# EAGLE design DMXto16Ch (EAGLE 9.2.2)
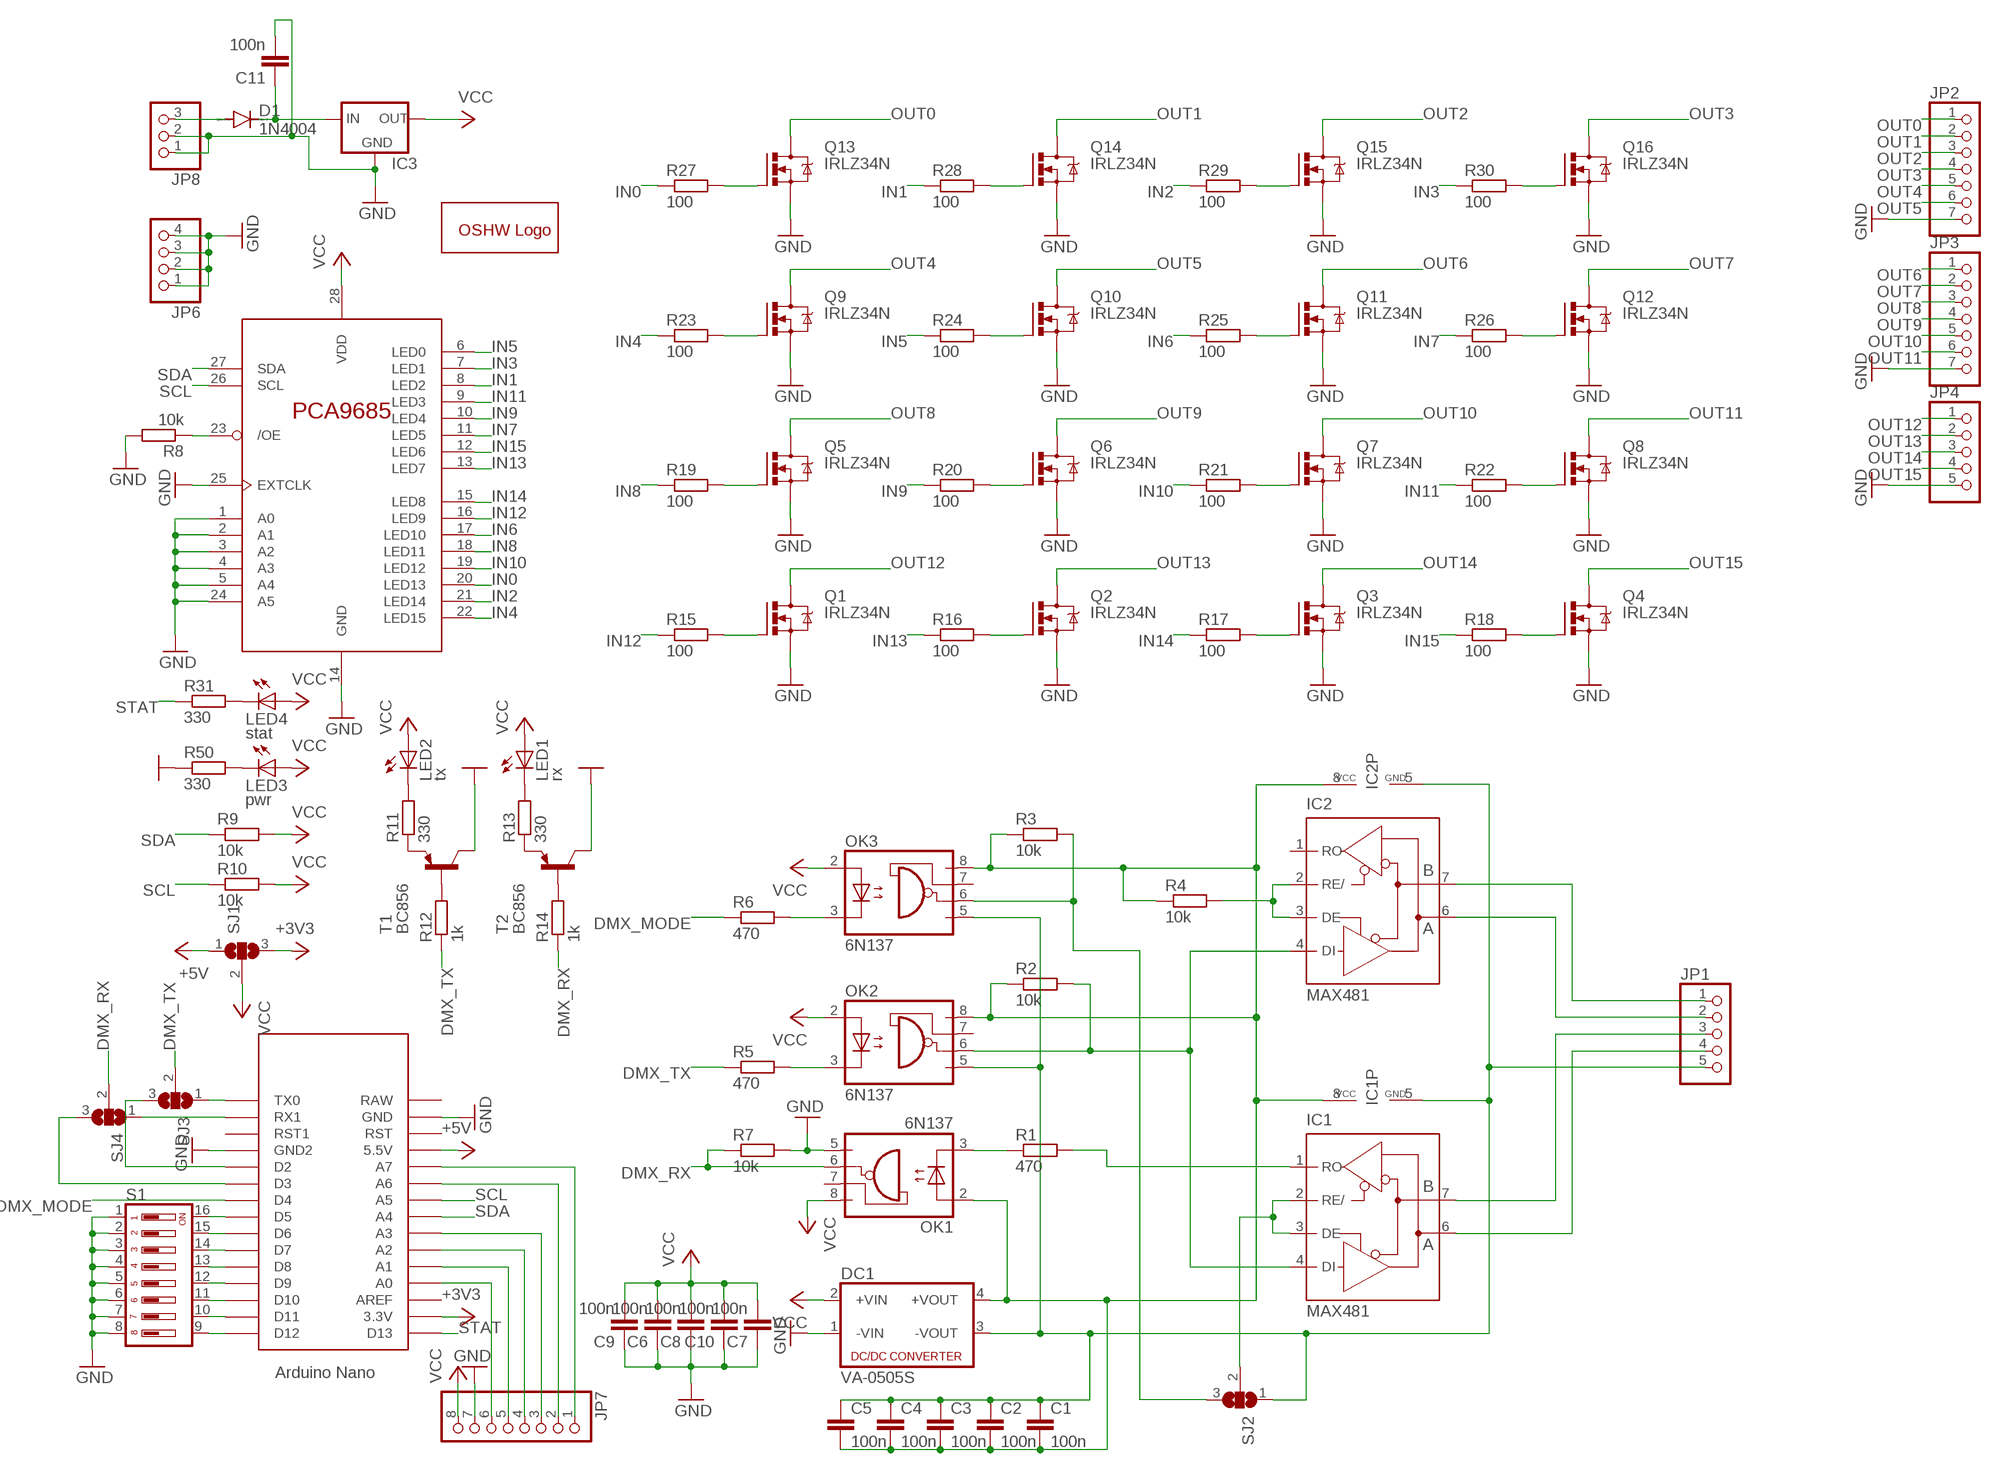
[diagram p0: schematic, sheet 1]

## Parts
C1  100n  C-EUC1206  [C1206]
C2  100n  C-EUC1206  [C1206]
C3  100n  C-EUC1206  [C1206]
C4  100n  C-EUC1206  [C1206]
C5  100n  C-EUC1206  [C1206]
C6  100n  C-EUC1206  [C1206]
C7  100n  C-EUC1206  [C1206]
C8  100n  C-EUC1206  [C1206]
C9  100n  C-EUC1206  [C1206]
C10  100n  C-EUC1206  [C1206]
C11  100n  C-EUC1206  [C1206]
D1  1N4004  [DO41-10]
DC1  VA-0505S  [4SIL]
GOLD_ORB_SM1  OSHWLOGOLOGO5MM  [OSHW_5MM]
IC1  MAX481  MAX481CPA  [DIL08]
IC2  MAX481  MAX481CPA  [DIL08]
IC3  78XXS  [78XXS]
JP1  PINHD-1X5  [1X05]
JP2  PINHD-1X7  [1X07]
JP3  PINHD-1X7  [1X07]
JP4  PINHD-1X5  [1X05]
JP6  PINHD-1X4  [1X04]
JP7  PINHD-1X8  [1X08]
JP8  PINHD-1X3  [1X03]
LED1  rx  LEDSMT1206  [1206]
LED2  tx  LEDSMT1206  [1206]
LED3  pwr  LEDSMT1206  [1206]
LED4  stat  LEDSMT1206  [1206]
OK1  6N137  [DIL08]
OK2  6N137  [DIL08]
OK3  6N137  [DIL08]
Q1  IRLZ34N  IRF520  [TO220BV]
Q2  IRLZ34N  IRF520  [TO220BV]
Q3  IRLZ34N  IRF520  [TO220BV]
Q4  IRLZ34N  IRF520  [TO220BV]
Q5  IRLZ34N  IRF520  [TO220BV]
Q6  IRLZ34N  IRF520  [TO220BV]
Q7  IRLZ34N  IRF520  [TO220BV]
Q8  IRLZ34N  IRF520  [TO220BV]
Q9  IRLZ34N  IRF520  [TO220BV]
Q10  IRLZ34N  IRF520  [TO220BV]
Q11  IRLZ34N  IRF520  [TO220BV]
Q12  IRLZ34N  IRF520  [TO220BV]
Q13  IRLZ34N  IRF520  [TO220BV]
Q14  IRLZ34N  IRF520  [TO220BV]
Q15  IRLZ34N  IRF520  [TO220BV]
Q16  IRLZ34N  IRF520  [TO220BV]
R1  470  R-EU_R1206  [R1206]
R2  10k  R-EU_R1206  [R1206]
R3  10k  R-EU_R1206  [R1206]
R4  10k  R-EU_R1206  [R1206]
R5  470  R-EU_R1206  [R1206]
R6  470  R-EU_R1206  [R1206]
R7  10k  R-EU_R1206  [R1206]
R8  10k  R-EU_R1206  [R1206]
R9  10k  R-EU_R1206  [R1206]
R10  10k  R-EU_R1206  [R1206]
R11  330  R-EU_R1206  [R1206]
R12  1k  R-EU_R1206  [R1206]
R13  330  R-EU_R1206  [R1206]
R14  1k  R-EU_R1206  [R1206]
R15  100  R-EU_R1206  [R1206]
R16  100  R-EU_R1206  [R1206]
R17  100  R-EU_R1206  [R1206]
R18  100  R-EU_R1206  [R1206]
R19  100  R-EU_R1206  [R1206]
R20  100  R-EU_R1206  [R1206]
R21  100  R-EU_R1206  [R1206]
R22  100  R-EU_R1206  [R1206]
R23  100  R-EU_R1206  [R1206]
R24  100  R-EU_R1206  [R1206]
R25  100  R-EU_R1206  [R1206]
R26  100  R-EU_R1206  [R1206]
R27  100  R-EU_R1206  [R1206]
R28  100  R-EU_R1206  [R1206]
R29  100  R-EU_R1206  [R1206]
R30  100  R-EU_R1206  [R1206]
R31  330  R-EU_R1206  [R1206]
R50  330  R-EU_R1206  [R1206]
S1  DIP08YL  [DIP08YL]
SJ1  SJ2W  [SJ_2]
SJ2  SJ2W  [SJ_2]
SJ3  SJ2W  [SJ_2]
SJ4  SJ2W  [SJ_2]
T1  BC856  -PNP-SOT23-BCE  [SOT23-BCE]
T2  BC856  -PNP-SOT23-BCE  [SOT23-BCE]
U$1  NANO  [NANO]
U$2  PCA9685PW  [TSSOP28]

## Nets
+3V3: SJ1.3 U$1.3.3V
+5V: SJ1.1 U$1.5V(5.5V)
DMX_MODE: R6.1 U$1.D4
DMX_RX: OK1.6(VO) R7.1 R14.1 SJ4.2
DMX_TX: R5.1 R12.1 SJ3.2
GND: C6.1 C7.1 C8.1 C9.1 C10.1 C11.2 DC1.1(-VIN) IC3.GND JP2.7 JP3.7 JP4.5 JP6.1 JP6.2 JP6.3 JP6.4 JP7.7 JP8.1 JP8.2 OK1.5(GND) Q1.S Q2.S Q3.S Q4.S Q5.S Q6.S Q7.S Q8.S Q9.S Q10.S Q11.S Q12.S Q13.S Q14.S Q15.S Q16.S R7.2 R8.2 R50.1 S1.1 S1.2 S1.3 S1.4 S1.5 S1.6 S1.7 S1.8 T1.C T2.C U$1.GND U$1.GND1(GND2) U$2.1(A0) U$2.2(A1) U$2.3(A2) U$2.4(A3) U$2.5(A4) U$2.14(GND) U$2.24(A5) U$2.25(EXTCLK)
IN0: R27.1 U$2.20(LED13)
IN1: R28.1 U$2.8(LED2)
IN2: R29.1 U$2.21(LED14)
IN3: R30.1 U$2.7(LED1)
IN4: R23.1 U$2.22(LED15)
IN5: R24.1 U$2.6(LED0)
IN6: R25.1 U$2.17(LED10)
IN7: R26.1 U$2.11(LED5)
IN8: R19.1 U$2.18(LED11)
IN9: R20.1 U$2.10(LED4)
IN10: R21.1 U$2.19(LED12)
IN11: R22.1 U$2.9(LED3)
IN12: R15.1 U$2.16(LED9)
IN13: R16.1 U$2.13(LED7)
IN14: R17.1 U$2.15(LED8)
IN15: R18.1 U$2.12(LED6)
N$1: C1.2 C2.2 C3.2 C4.2 C5.2 DC1.4(+VOUT) IC1.8(VCC) IC2.8(VCC) OK1.2(A) OK2.8(VCC) OK3.8(VCC) R2.1 R3.1 R4.1
N$2: R8.1 U$2.23(/OE)
N$3: IC2.7(B) JP1.1
N$4: IC2.6(A) JP1.2
N$5: IC1.7(B) JP1.3
N$6: IC1.6(A) JP1.4
N$7: R12.2 T1.B
N$8: OK1.3(C) R1.1
N$9: IC1.1(RO) R1.2
N$10: IC1.4(DI) IC2.4(DI) OK2.6(VO) R2.2
N$11: C1.1 C2.1 C3.1 C4.1 C5.1 DC1.3(-VOUT) IC1.5(GND) IC2.5(GND) JP1.5 OK2.5(GND) OK3.5(GND) SJ2.1
N$12: OK3.6(VO) R3.2 SJ2.3
N$13: R13.1 T2.E
N$14: IC1.2(RE/) IC1.3(DE) SJ2.2
N$15: IC2.2(RE/) IC2.3(DE) R4.2
N$16: LED1.C R13.2
N$17: R14.2 T2.B
N$18: OK2.3(C) R5.2
N$19: OK3.3(C) R6.2
N$20: Q1.G R15.2
N$21: Q2.G R16.2
N$22: Q3.G R17.2
N$23: Q4.G R18.2
N$24: Q5.G R19.2
N$25: Q6.G R20.2
N$26: R11.1 T1.E
N$27: LED2.C R11.2
N$28: Q7.G R21.2
N$29: Q8.G R22.2
N$30: Q9.G R23.2
N$31: Q10.G R24.2
N$32: Q11.G R25.2
N$33: Q12.G R26.2
N$34: Q13.G R27.2
N$35: Q14.G R28.2
N$36: Q15.G R29.2
N$37: Q16.G R30.2
N$38: S1.9 U$1.D12
N$39: S1.10 U$1.D11
N$40: S1.11 U$1.D10
N$41: S1.12 U$1.D9
N$42: S1.13 U$1.D8
N$43: S1.14 U$1.D7
N$44: S1.15 U$1.D6
N$45: S1.16 U$1.D5
N$46: SJ4.1 U$1.RX1
N$47: SJ3.1 U$1.TX0
N$48: SJ3.3 U$1.D2
N$49: SJ4.3 U$1.D3
N$50: LED3.C R50.2
N$51: D1.A JP8.3
N$52: C11.1 D1.C IC3.IN
N$53: JP7.1 U$1.A7
N$54: JP7.2 U$1.A6
N$55: JP7.3 U$1.A3
N$56: JP7.4 U$1.A2
N$57: JP7.5 U$1.A1
N$58: JP7.6 U$1.A0
N$59: LED4.C R31.2
OUT0: JP2.1 Q13.D
OUT1: JP2.2 Q14.D
OUT2: JP2.3 Q15.D
OUT3: JP2.4 Q16.D
OUT4: JP2.5 Q9.D
OUT5: JP2.6 Q10.D
OUT6: JP3.1 Q11.D
OUT7: JP3.2 Q12.D
OUT8: JP3.3 Q5.D
OUT9: JP3.4 Q6.D
OUT10: JP3.5 Q7.D
OUT11: JP3.6 Q8.D
OUT12: JP4.1 Q1.D
OUT13: JP4.2 Q2.D
OUT14: JP4.3 Q3.D
OUT15: JP4.4 Q4.D
SCL: R10.1 U$1.A5 U$2.26(SCL)
SDA: R9.1 U$1.A4 U$2.27(SDA)
STAT: R31.1 U$1.D13
VCC: C6.2 C7.2 C8.2 C9.2 C10.2 DC1.2(+VIN) IC3.OUT JP7.8 LED1.A LED2.A LED3.A LED4.A OK1.8(VCC) OK2.2(A) OK3.2(A) R9.2 R10.2 SJ1.2 U$2.28(VDD)
Unconnected: IC2.1(RO) OK1.7(VE) OK2.7(VE) OK3.7(VE) U$1.AREF U$1.ICSP1 U$1.ICSP2 U$1.ICSP3 U$1.ICSP4 U$1.ICSP5 U$1.ICSP6 U$1.RAW U$1.RST U$1.RST1

## Library data of the parts
C1-C11 = resistor:C-EU: CAPACITOR, European symbol
D1 = diode:1N4004: DIODE general purpose rectifier, 1 A
DC1 = dc-dc-converter:VA-*?: DC DC Converter Single Output, 1 Watt Motien Technology Co.,Ltd. Source: va-serie.pdf
GOLD_ORB_SM1 = oshw:OSHWLOGO: The OSHW logo for PCB layout
IC1 IC2 = maxim:MAX481CPA: RS485 TRANSEIVER
IC3 = v-reg:78XXS: VOLTAGE REGULATOR
JP1 JP4 = pinhead:PINHD-1X5: PIN HEADER
JP2 JP3 = pinhead:PINHD-1X7: PIN HEADER
JP6 = pinhead:PINHD-1X4: PIN HEADER
JP7 = pinhead:PINHD-1X8: PIN HEADER
JP8 = pinhead:PINHD-1X3: PIN HEADER
LED1-LED4 = led:LED: LED OSRAM: - CHIPLED LG R971, LG N971, LY N971, LG Q971, LY Q971, LO R971, LY R971 LH N974, LH R974 LS Q976, LO Q976, LY Q976 LO Q996 - Hyper CHIPLED LW Q18S LB Q993, LB Q99A, LB R99A - SideLED LS A670, LO A670, LY A670, LG A670, LP A670 LB A673, LV A673, LT A673, LW A673 LH A674 LY A675 LS A676, LA A676, LO A676, LY A676, LW A676 LS A679, LY A679, LG A679 - Hyper Micro SIDELED® LS Y876, LA Y876, LO Y876, LY Y876 LT Y87S - SmartLED LW L88C, LW L88S LB L89C, LB L89S, LG L890 LS L89K, LO L89K, LY L89K LS L896, LA L896, LO L896, LY L896 - TOPLED LS T670, LO T670, LY T670, LG T670, LP T670 LSG T670, LSP T670, LSY T670, LOP T670, LYG T670 LG T671, LOG T671, LSG T671 LB T673, LV T673, LT T673, LW T673 LH T674 LS T676, LA T676, LO T676, LY T676, LB T676, LH T676, LSB T676, LW T676 LB T67C, LV T67C, LT T67C, LS T67K, LO T67K, LY T67K, LW E67C LS E67B, LA E67B, LO E67B, LY E67B, LB E67C, LV E67C, LT E67C LW T67C LS T679, LY T679, LG T679 LS T770, LO T770, LY T770, LG T770, LP T770 LB T773, LV T773, LT T773, LW T773 LH T774 LS E675, LA E675, LY E675, LS T675 LS T776, LA T776, LO T776, LY T776, LB T776 LHGB T686 LT T68C, LB T68C - Hyper Mini TOPLED® LB M676 - Mini TOPLED Santana® LG M470 LS M47K, LO M47K, LY M47K Source: http://www.osram.convergy.de LUXEON: - LUMILED® LXK2-PW12-R00, LXK2-PW12-S00, LXK2-PW14-U00, LXK2-PW14-V00 LXK2-PM12-R00, LXK2-PM12-S00, LXK2-PM14-U00 LXK2-PE12-Q00, LXK2-PE12-R00, LXK2-PE12-S00, LXK2-PE14-T00, LXK2-PE14-U00 LXK2-PB12-K00, LXK2-PB12-L00, LXK2-PB12-M00, LXK2-PB14-N00, LXK2-PB14-P00, LXK2-PB14-Q00 LXK2-PR12-L00, LXK2-PR12-M00, LXK2-PR14-Q00, LXK2-PR14-R00 LXK2-PD12-Q00, LXK2-PD12-R00, LXK2-PD12-S00 LXK2-PH12-R00, LXK2-PH12-S00 LXK2-PL12-P00, LXK2-PL12-Q00, LXK2-PL12-R00 Source: www.luxeon.com KINGBRIGHT: KA-3528ASYC Source: www.kingbright.com
OK1-OK3 = optocoupler:6N137: MOTOROLA OPTO COUPLER; MPN: 6N137; OC_FARNELL: 1328376; OC_NEWARK: 52M1895
Q1-Q16 = transistor-power:IRF520: HEXFET Power MOSFET
R1-R31 R50 = resistor:R-EU_: RESISTOR, European symbol
S1 = switch-dil:DIP08YL: DIL/CODE SWITCH; OC_FARNELL: unknown; OC_NEWARK: unknown
SJ1-SJ4 = jumper:SJ2W: SMD solder JUMPER
T1 T2 = transistor:*-PNP-: PNP Transistror
U$1 = Arduino-clone:NANO: Arduino Nano
U$2 = i2c-led-controller:PCA9685

## Board
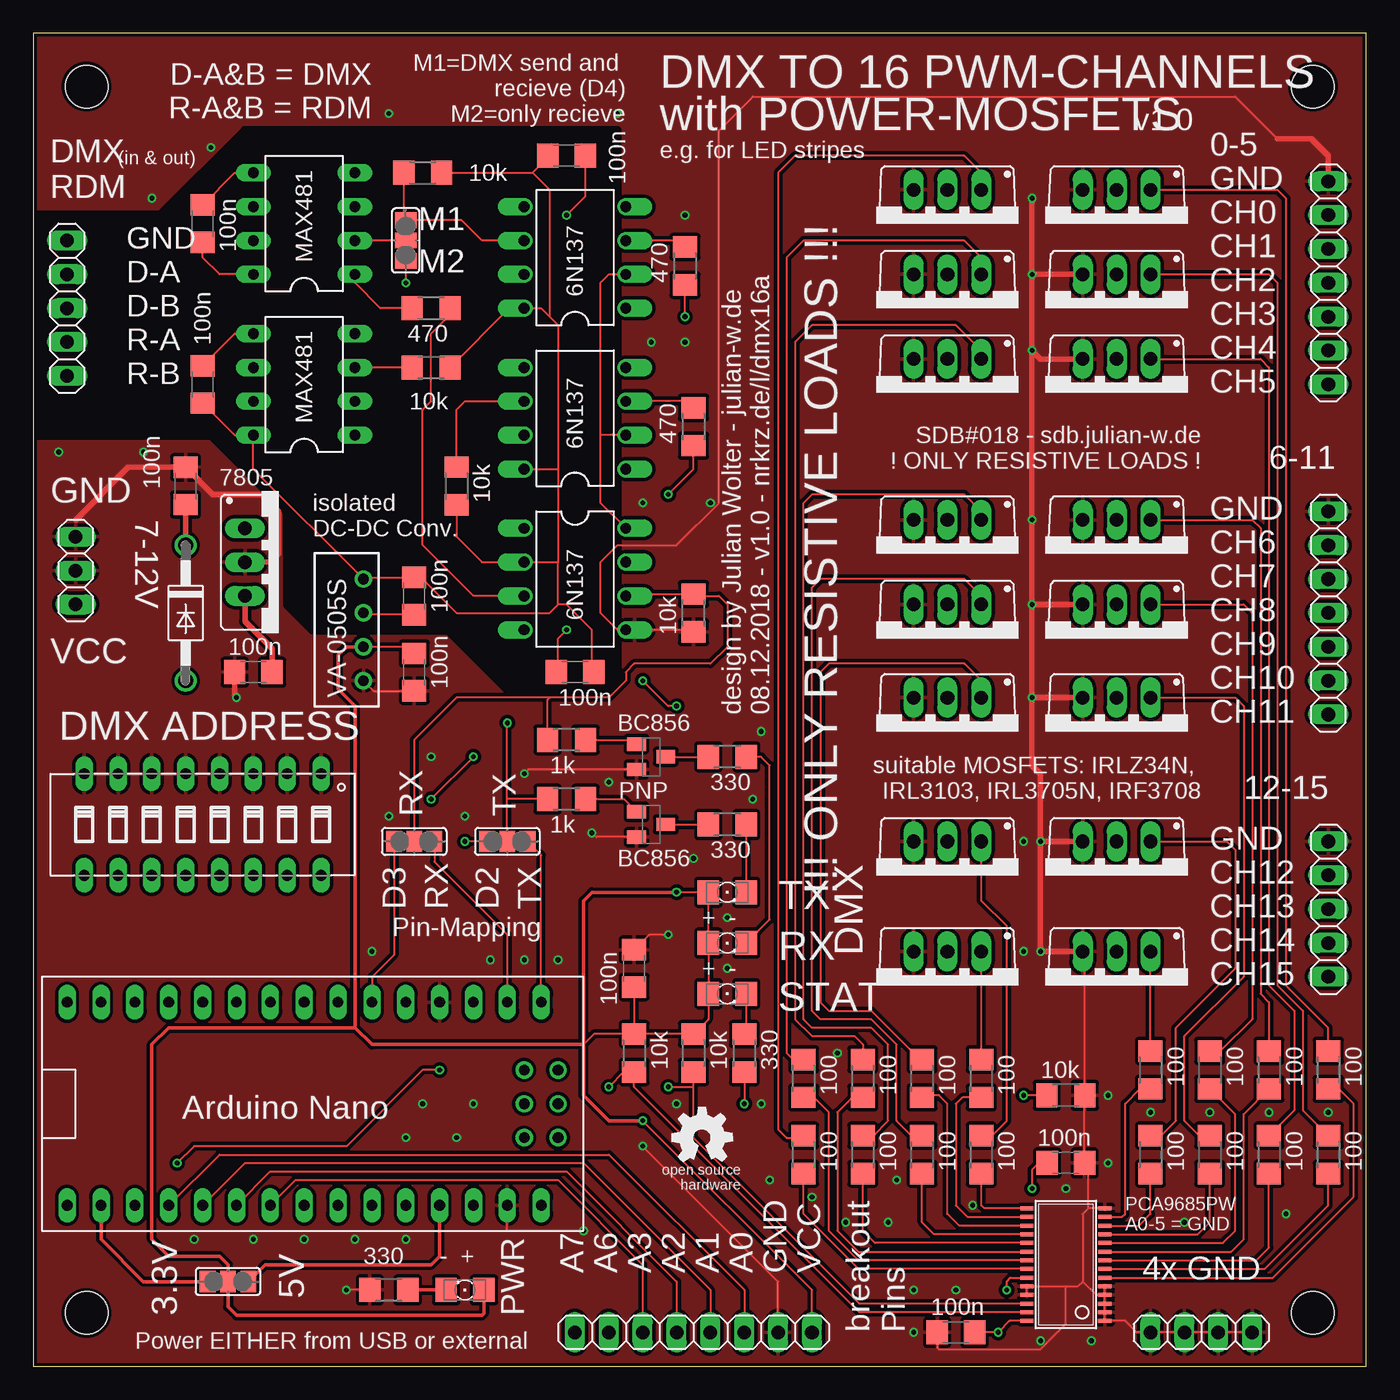
[diagram p1: board, top side]
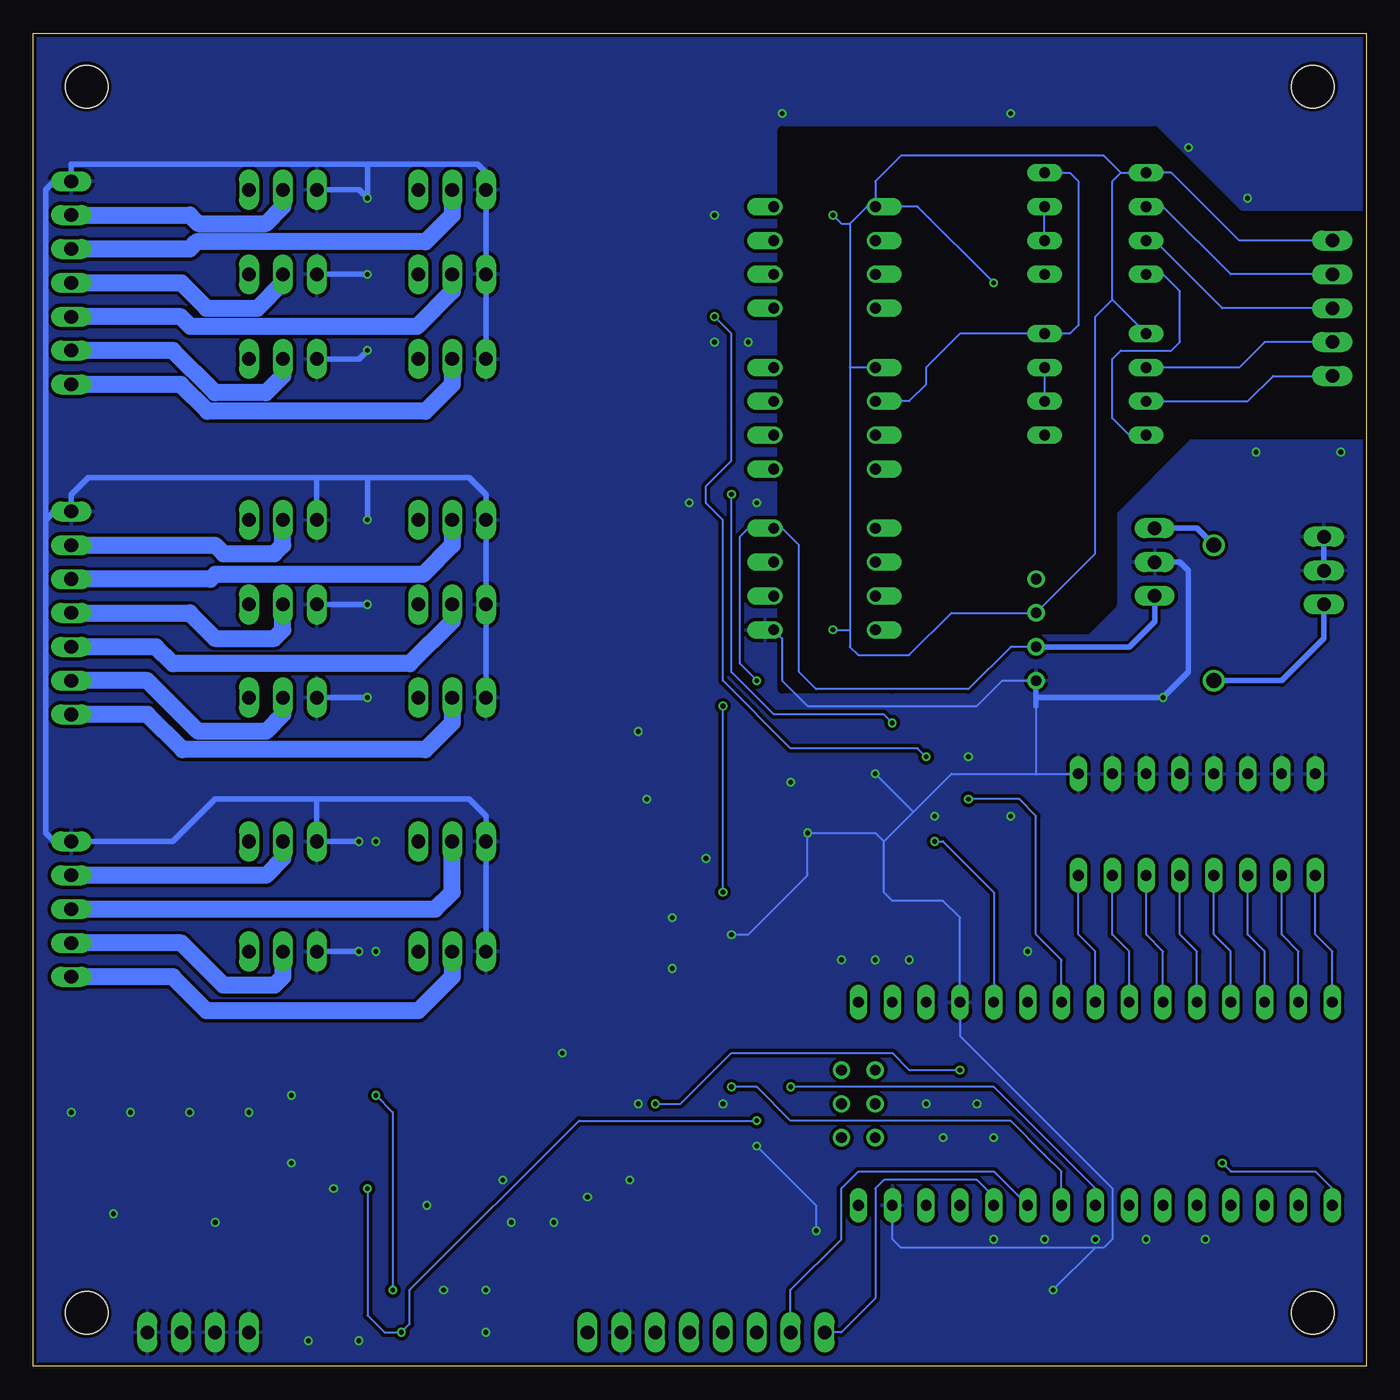
[diagram p2: board, bottom side, seen from below]

Size 100 x 100 mm. Coordinates in mm from the lower left corner, seen from the top.
Outline: 0,0 100,0 100,100 0,100 0,0
Copper layers (1*16): Top 0.035mm / dielectric 1.5mm / Bottom 0.035mm
Design rules "aisler_2_layer": minimum track width 0.1mm, minimum drill 0.2mm, track to track 0.1mm, track to pad 0.1mm, pad to pad 0.1mm, via to via 0.1mm, smd to smd 0.1mm, copper to edge 0.2mm, drill to drill 0.21mm, minimum pad ring 0.25mm, minimum via ring 0.15mm, stop-mask expansion 0mil, vias tented up to drill 0mil, thermal gap 10mil
Holes 3.2 mm at 4,4 96,4 96,96 4,96
tRestrict: area -1.9,50.8 to 43.8,92.7
bRestrict: area -1.9,50.8 to 43.8,92.7

### Footprints (pad centres in the part's own frame; a part is rotated, then mirrored left to right if it is on the bottom)
C1206 = smd 1.6 x 1.8: 1 -1.4,0; 2 1.4,0
DO41-10 = drill 1.118: A 5.08,0; C -5.08,0
4SIL = drill 0.8: 1 -3.81,0; 2 -1.27,0; 3 1.27,0; 4 3.81,0
DIL08 = drill 0.813 long: 1 -3.81,-3.81; 2 -1.27,-3.81; 3 1.27,-3.81; 4 3.81,-3.81; 5 3.81,3.81; 6 1.27,3.81; 7 -1.27,3.81; 8 -3.81,3.81
78XXS = drill 1.016 long: GND 0,-2.54; IN -2.54,-2.54; OUT 2.54,-2.54
1X05 = drill 1.016 long: 1 -5.08,0; 2 -2.54,0; 3 0,0; 4 2.54,0; 5 5.08,0
1X07 = drill 1.016 long: 1 -7.62,0; 2 -5.08,0; 3 -2.54,0; 4 0,0; 5 2.54,0; 6 5.08,0; 7 7.62,0
1X04 = drill 1.016 long: 1 -3.81,0; 2 -1.27,0; 3 1.27,0; 4 3.81,0
1X08 = drill 1.016 long: 1 -8.89,0; 2 -6.35,0; 3 -3.81,0; 4 -1.27,0; 5 1.27,0; 6 3.81,0; 7 6.35,0; 8 8.89,0
1X03 = drill 1.016 long: 1 -2.54,0; 2 0,0; 3 2.54,0
1206 = smd 1.6 x 1.803: A -1.422,0; C 1.422,0
DIL08' = drill 0.813 offset: 1 -3.81,-3.81; 2 -1.27,-3.81; 3 1.27,-3.81; 4 3.81,-3.81; 5 3.81,3.81; 6 1.27,3.81; 7 -1.27,3.81; 8 -3.81,3.81
TO220BV = drill 1.016 long: D 0,-2.54; G -2.54,-2.54; S 2.54,-2.54
R1206 = smd 1.6 x 1.803: 1 -1.422,0; 2 1.422,0
DIP08YL = drill 0.813 long: 1 -8.89,-3.81; 2 -6.35,-3.81; 3 -3.81,-3.81; 4 -1.27,-3.81; 5 1.27,-3.81; 6 3.81,-3.81; 7 6.35,-3.81; 8 8.89,-3.81; 9 8.89,3.81; 10 6.35,3.81; 11 3.81,3.81; 12 1.27,3.81; 13 -1.27,3.81; 14 -3.81,3.81; 15 -6.35,3.81; 16 -8.89,3.81
SJ_2 = smd 1.168 x 1.6: 1 -1.524,0; 2 0,0; 3 1.524,0
SOT23-BCE = smd 1 x 1.4: B -0.95,-1.1; C 0.95,-1.1; E 0,1.1
NANO = drill 0.8 long: 3.3V -10.16,24.13; 5V -10.16,-1.27; A0 -10.16,19.05; A1 -10.16,16.51; A2 -10.16,13.97; A3 -10.16,11.43; A4 -10.16,8.89; A5 -10.16,6.35; A6 -10.16,3.81; A7 -10.16,1.27; AREF -10.16,21.59; D2 5.08,1.27; D3 5.08,3.81; D4 5.08,6.35; D5 5.08,8.89; D6 5.08,11.43; D7 5.08,13.97; D8 5.08,16.51; D9 5.08,19.05; D10 5.08,21.59; D11 5.08,24.13; D12 5.08,26.67; D13 -10.16,26.67; GND -10.16,-6.35; GND1 5.08,-1.27; RAW -10.16,-8.89; RST -10.16,-3.81; RST1 5.08,-3.81; RX1 5.08,-6.35; TX0 5.08,-8.89 | drill 0.8: ICSP1 -5.08,-10.16; ICSP2 -5.08,-7.62; ICSP3 -2.54,-10.16; ICSP4 -2.54,-7.62; ICSP5 0,-10.16; ICSP6 0,-7.62
TSSOP28 = smd 0.305 x 0.991: 1 -4.225,-2.918; 2 -3.575,-2.918; 3 -2.925,-2.918; 4 -2.275,-2.918; 5 -1.625,-2.918; 6 -0.975,-2.918; 7 -0.325,-2.918; 8 0.325,-2.918; 9 0.975,-2.918; 10 1.625,-2.918; 11 2.275,-2.918; 12 2.925,-2.918; 13 3.575,-2.918; 14 4.225,-2.918; 15 4.225,2.918; 16 3.575,2.918; 17 2.925,2.918; 18 2.275,2.918; 19 1.625,2.918; 20 0.975,2.918; 21 0.325,2.918; 22 -0.325,2.918; 23 -0.975,2.918; 24 -1.625,2.918; 25 -2.275,2.918; 26 -2.925,2.918; 27 -3.575,2.918; 28 -4.225,2.918

### Placement (x,y rotation side)
C1  12.7,85.72 270 top
C2  12.7,73.66 270 top
C3  28.57,57.78 90 top
C4  40.01,90.81 180 top
C5  40.64,52.07 0 top
C6  45.09,29.84 270 top
C7  28.57,52.07 90 top
C8  77.47,15.24 180 top
C9  69.22,2.54 0 top
C10  16.51,52.07 0 top
C11  11.43,66.04 90 top
D1  11.43,56.52 270 top
DC1  24.77,55.24 90 top
GOLD_ORB_SM1  50.16,17.14 0 top
IC1  20.32,85.72 90 top
IC2  20.32,73.66 90 top
IC3  18.41,60.33 270 top
JP1  2.54,79.38 90 top
JP2  97.16,81.28 90 top
JP3  97.16,56.52 90 top
JP4  97.16,34.29 90 top
JP6  87.63,2.54 0 top
JP7  49.53,2.54 0 top
JP8  3.17,59.69 270 top
LED1  52.07,31.75 0 top
LED2  52.07,35.56 0 top
LED3  32.38,5.71 180 top
LED4  52.07,27.94 0 top
OK1  6N137  [DIL08']  40.64,59.05 270 top
OK2  6N137  [DIL08']  40.64,71.12 90 top
OK3  6N137  [DIL08']  40.64,83.19 90 top
Q1  68.58,28.57 180 top
Q2  81.28,28.57 180 top
Q3  68.58,36.83 180 top
Q4  81.28,36.83 180 top
Q5  68.58,54.61 180 top
Q6  81.28,54.61 180 top
Q7  68.58,60.96 180 top
Q8  81.28,60.96 180 top
Q9  68.58,85.72 180 top
Q10  81.28,85.72 180 top
Q11  68.58,47.62 180 top
Q12  81.28,47.62 180 top
Q13  68.58,73.03 180 top
Q14  81.28,73.03 180 top
Q15  68.58,79.38 180 top
Q16  81.28,79.38 180 top
R1  29.84,79.38 180 top
R2  31.75,66.04 90 top
R3  29.21,89.53 180 top
R4  29.84,74.93 180 top
R5  49.53,70.48 90 top
R6  48.9,82.55 90 top
R7  49.53,56.52 270 top
R8  77.47,20.32 0 top
R9  45.09,23.5 90 top
R10  49.53,23.5 90 top
R11  52.07,40.64 0 top
R12  40.01,42.55 0 top
R13  52.07,45.72 0 top
R14  40.01,46.99 0 top
R15  71.12,21.59 90 top
R16  83.82,22.23 90 top
R17  71.12,15.88 90 top
R18  83.82,15.88 90 top
R19  66.67,15.88 90 top
R20  88.27,22.23 90 top
R21  62.23,15.88 90 top
R22  92.71,22.23 90 top
R23  57.78,15.88 90 top
R24  97.16,22.23 90 top
R25  66.67,21.59 90 top
R26  88.27,15.88 90 top
R27  62.23,21.59 90 top
R28  92.71,15.88 90 top
R29  57.78,21.59 90 top
R30  97.16,15.88 90 top
R31  53.34,23.5 90 top
R50  26.67,5.71 0 top
S1  12.7,40.64 180 top
SJ1  14.61,6.35 180 top
SJ2  27.94,84.45 90 top
SJ3  35.56,39.37 180 top
SJ4  28.57,39.37 180 top
T1  46.35,40.64 270 top
T2  46.35,45.72 270 top
U$1  29.21,22.23 90 top
U$2  77.47,7.62 90 top

### Tracks (layer width: path | path; a pad name or v marks a point on that pad's centre or on a via)
+3V3
  Top 0.254: U$1.3.3V 5.08,9.53 8.26,6.35 SJ1.3
+5V
  Top 0.254: SJ1.1 17.4,7.62 29.84,7.62 30.48,8.26 U$1.5V
DMX_MODE  (via drill 0.35)
  Top 0.152: v29.84,42.55 v33.02,45.72 | v48.9,78.74 R6.1
  Bottom 0.152: U$1.D4 22.86,30.48 24.77,32.38 24.77,41.27 26.04,42.55 v29.84,42.55 | v33.02,45.72 33.66,46.35 43.18,46.35 48.26,51.44 48.26,63.5 49.53,64.77 49.53,66.04 47.62,67.94 47.62,77.47 v48.9,78.74
DMX_RX
  Top 0.152: OK1.6 44.6,57.94 R7.1 49.68,57.78 51.44,57.78 52.07,57.15 52.07,53.98 50.8,52.7 45.09,52.7 44.45,52.07 44.45,51.44 43.18,50.16 38.73,50.16 | SJ4.2 28.57,46.99 31.75,50.16 38.73,50.16 | R14.1 38.58,50.01 38.73,50.16
DMX_TX  (via drill 0.35)
  Top 0.152: SJ3.2 35.56,42.55 | 35.56,42.55 v35.56,48.26 | v47.62,65.41 49.53,67.31 R5.1 | R12.1 35.56,42.55
  Bottom 0.152: v35.56,48.26 36.2,48.9 44.45,48.9 47.62,52.07 v47.62,65.41
GND  (via drill 0.35)
  Top 0.15: OK1.5 43.81,55.24 42.55,56.52 42.55,60.33 43.81,61.59 48.26,61.59 51.44,64.77 51.44,92.71 53.98,95.25 90.17,95.25 93.34,92.08 | U$2.1 U$2.2 U$2.3 U$2.4 | U$2.4 U$2.5 | U$2.14 79.16,11.85 | 79.16,11.85 78.74,11.43 78.74,6.35 | 78.74,6.35 79.75,5.34 U$2.4 | U$2.25 U$2.24 77.47,6 | 77.47,6 78.39,6 78.74,6.35 | DC1.1 25.53,50.67 C7.1 | 79.16,11.85 79.16,14.96 C8.1 78.87,20.3 R8.2 78.89,30.96 Q2.S | C9.1 67.81,1.4 67.94,1.27 75.56,1.27 77.47,3.17 77.47,6 | C6.1 46.23,32.38 v47.62,32.38 | v45.72,16.51 55.88,6.35 JP7.7 | v41.27,10.16 35.56,10.16 U$1.GND
  Top 0.152: R7.2 49.38,55.24 OK1.5 | S1.1 S1.2 S1.3 S1.4 S1.5 S1.6 S1.7 S1.8 | T1.C 42.23,39.69 v41.91,40.01 | T2.C 37.15,44.77 v36.83,44.45 | R50.1 v23.5,5.71 | U$2.1 81.92,3.4 82.77,2.54 JP6.1 JP6.2 JP6.3 JP6.4
  Top 0.406: v74.93,76.2 v74.93,81.92 | v74.93,87.63 v74.93,81.92 | v74.93,57.15 v74.93,63.5 v74.93,76.2 | v74.93,57.15 Q6.S | Q12.S v74.93,50.16 | v74.93,50.16 v74.93,57.15 | v75.56,39.37 v75.56,31.11 Q2.S | 93.34,92.08 95.89,92.08 97.16,90.81 JP2.7 | v75.56,39.37 75.56,44.45 74.93,45.09 v74.93,50.16 | v75.56,39.37 Q4.S | Q16.S v74.93,81.92 | Q14.S 75.56,75.56 v74.93,76.2 | 3.17,63.5 7.12,67.44 C11.2 13.46,65.41 17.14,65.41 18.41,64.14 18.41,60.96 17.78,60.33 IC3.GND | C10.1 15.11,50.3 v15.24,50.16
  Bottom 0.15: v47.62,32.38 46.35,32.38 41.91,36.83 v41.91,40.01 | v45.72,16.51 41.27,12.06 v41.27,10.16
  Bottom 0.152: OK1.5 43.81,54.61 43.81,51.44 41.91,49.53 29.21,49.53 27.3,51.44 DC1.1 | 36.2,39.37 36.2,35.56 35.56,34.92 31.75,34.92 30.48,33.66 U$1.GND1 30.48,24.77 19.05,13.34 19.05,9.53 19.68,8.89 20.32,8.89 | 36.2,39.37 33.97,41.59 | 33.97,41.59 31.11,44.45 24.77,44.45 | 24.77,44.45 S1.1 | 24.77,49.53 24.77,44.45 | v41.91,40.01 36.83,40.01 36.2,39.37 | v36.83,44.45 33.97,41.59 | U$1.GND 35.56,9.53 34.92,8.89 20.32,8.89 | 20.32,8.89 v23.5,5.71
  Bottom 0.406: Q14.S 75.56,75.56 v74.93,76.2 | v74.93,81.92 Q16.S | Q10.S 75.56,88.27 v74.93,87.63 74.93,90.17 | Q13.S Q15.S Q9.S 66.04,89.53 66.67,90.17 74.93,90.17 | 74.93,90.17 97.16,90.17 JP2.7 98.42,88.9 99.06,88.27 99.06,63.5 | Q11.S Q5.S Q7.S 66.04,65.41 67.31,66.67 74.93,66.67 | 74.93,66.67 78.74,66.67 | 78.74,66.67 95.89,66.67 97.16,65.41 JP3.7 98.42,64.14 99.06,63.5 | Q8.S 78.74,66.67 | 74.93,66.67 v74.93,63.5 | Q12.S v74.93,50.16 | Q6.S v74.93,57.15 | Q1.S Q3.S 66.04,41.27 67.31,42.55 78.74,42.55 | 78.74,42.55 86.36,42.55 89.53,39.37 JP4.5 98.42,39.37 99.06,40.01 99.06,63.5 | Q2.S v75.56,31.11 | v75.56,39.37 Q4.S 78.74,42.55 | 24.77,50.16 v15.24,50.16 13.34,52.07 13.34,59.69 13.97,60.33 IC3.GND | 24.77,49.53 24.77,50.16 | 24.77,50.16 DC1.1 | JP8.2 JP8.1
  other vias: 27.94,17.14 31.75,17.14 29.21,19.68 33.02,19.68 55.24,13.97 80.64,15.24 80.64,20.32 66.04,2.54 66.04,5.71 69.22,5.71 12.06,9.53 16.51,9.53 20.32,9.53 24.13,9.53 27.94,9.53 64.14,10.79 64.77,13.97 75.56,1.91 79.38,1.91 77.47,13.34 86.36,10.79 93.98,11.43 88.27,19.05 83.82,19.05 92.71,19.05 97.16,19.05 60.33,23.5 54.61,19.68 58.42,12.7 60.96,10.79 70.48,12.06 74.3,31.11 74.3,39.37 45.72,64.77 50.8,64.77 46.35,76.83 48.9,76.83 48.9,86.36 8.89,87.63 13.34,91.44 26.67,93.98 43.81,93.98 29.84,45.72 32.38,41.27 26.67,41.27 36.83,30.48 39.37,30.48 34.29,30.48 25.4,31.11 1.91,68.58 8.26,68.58 53.98,42.55 54.61,47.62 43.18,43.81 49.53,38.1 52.07,33.66 52.07,29.84 48.26,19.68
  pour Bottom (isolate 0.254): 0,0 100.33,0 100.33,99.69 0,99.69
  pour Top (isolate 0.254): 0,0 100.33,0 100.33,99.69 0,99.69
IN0
  Top 0.15: R27.1 61.44,20.17 60.33,19.05 60.33,10.16 61.89,8.6 U$2.20
IN1
  Top 0.15: U$2.8 91.77,7.95 92.71,8.89 R28.1
IN2
  Top 0.15: U$2.21 61.91,7.95 59.69,10.16 59.69,19.05 58.57,20.17 R29.1
IN3
  Top 0.15: U$2.7 92.39,7.29 97.16,12.06 R30.1
IN4
  Top 0.15: U$2.22 61.92,7.29 57.78,11.43 R23.1
IN5
  Top 0.15: U$2.6 93,6.64 99.06,12.7 99.06,19.68 97.94,20.8 R24.1
IN6
  Top 0.15: U$2.17 69.47,10.54 68.58,11.43 68.58,19.68 67.94,20.32 66.83,20.32 R25.1
IN7
  Top 0.15: U$2.11 87.36,9.89 88.27,10.79 R26.1
IN8
  Top 0.15: U$2.18 67.58,9.89 66.67,10.79 R19.1
IN9
  Top 0.15: R20.1 90.17,18.9 90.17,10.16 89.25,9.24 U$2.10
IN10
  Top 0.15: R21.1 62.23,10.16 63.15,9.24 U$2.19
IN11
  Top 0.15: R22.1 90.81,18.9 90.81,9.53 89.88,8.6 U$2.9
IN12
  Top 0.15: R15.1 69.7,20.17 69.22,19.68 69.22,12.06 70.08,11.2 U$2.16
IN13
  Top 0.15: U$2.13 81.68,11.2 81.92,11.43 81.92,19.68 83.03,20.8 R16.1
IN14
  Top 0.15: U$2.15 71.34,11.85 71.12,12.06 R17.1
IN15
  Top 0.15: U$2.12 82.94,10.54 83.82,11.43 R18.1
N$1
  Top 0.152: 38.73,78.74 38.1,79.38 OK3.8 35.71,79.38 R4.1 | 38.73,78.74 39.37,78.11 39.37,67.31 | 39.37,67.31 39.37,60.33 | 39.37,60.33 OK1.2 33.66,60.33 31.75,62.23 R2.1 | OK2.8 39.37,67.31 | R3.1 37.47,89.53 | 37.47,89.53 38.73,88.27 38.73,78.74 | IC1.8 13.97,81.92 12.7,83.19 C1.2 | C2.2 15.11,69.85 IC2.8 16.51,67.31 DC1.4 24.89,59.19 C3.2 29.08,59.19 31.75,56.52 38.73,56.52 39.37,57.15 | 39.37,57.15 39.37,60.33 | C4.2 38.6,90.67 37.47,89.53 | C5.2 41.91,52.2 41.91,55.24 40.01,57.15 39.37,57.15
  Bottom 0.152: IC2.8 17.78,69.85 19.05,71.12 19.05,75.56 18.41,76.2 14.61,76.2 13.97,76.83 13.97,80.64 15.24,81.92 IC1.8
N$2  (via drill 0.35)
  Top 0.15: R8.1 v74.3,20.32 | v73.03,5.71 73.03,6.35 73.32,6.64 U$2.23
  Bottom 0.15: v74.3,20.32 73.03,19.05 v73.03,5.71
N$3
  Bottom 0.152: IC2.7 8.89,72.39 6.99,74.3 JP1.1
N$4
  Bottom 0.152: IC2.6 9.53,74.93 7.62,76.83 JP1.2
N$5
  Bottom 0.152: JP1.3 10.79,79.38 15.88,84.45 IC1.7
N$6
  Bottom 0.152: IC1.6 15.24,87 10.16,81.92 JP1.4
N$7
  Top 0.152: T1.B 44.3,42.55 R12.2
N$8
  Top 0.152: OK1.3 33.02,57.78 29.21,61.59 29.21,71.75 29.84,72.39 29.84,77.47 31.27,78.89 R1.1
N$9
  Top 0.152: R1.2 26.04,79.38 24.13,81.28 IC1.1
N$10
  Top 0.152: R2.2 31.75,71.75 32.38,72.39 OK2.6
  Bottom 0.152: IC1.4 22.23,89.53 21.59,88.9 21.59,78.11 22.23,77.47 IC2.4 30.48,77.47 33.02,74.93 33.02,73.66 34.29,72.39 OK2.6
N$11  (via drill 0.35)
  Top 0.152: SJ2.1 v27.94,81.28 | C1.1 15.11,89.53 IC1.5 | C2.1 15.11,77.47 IC2.5 | C3.1 24.89,56.38 DC1.3 | C4.1 41.41,87.76 v40.01,86.36 | C5.1 39.37,52.2 39.37,54.61 v40.01,55.24
  Bottom 0.152: IC2.5 19.05,80.01 | 18.41,89.53 19.05,88.9 19.05,80.01 | 18.41,89.53 IC1.5 14.61,89.53 9.53,84.45 JP1.5 | OK3.5 37.47,87 38.73,85.72 | 38.73,85.72 38.73,74.93 | OK2.5 38.73,74.93 | OK3.5 36.83,88.9 34.92,90.81 19.68,90.81 18.41,89.53 | v27.94,81.28 33.66,87 OK3.5 | 38.73,74.93 38.73,55.24 | 38.73,55.24 38.73,53.98 38.1,53.34 34.29,53.34 31.11,56.52 DC1.3 20.32,60.96 20.32,78.74 19.05,80.01 | v40.01,86.36 39.37,85.72 38.73,85.72 | v40.01,55.24 38.73,55.24
N$12
  Top 0.152: R3.2 27.79,86.13 SJ2.3 32.13,85.98 33.66,84.45 OK3.6
N$13
  Top 0.152: T2.E R13.1
N$14
  Top 0.152: SJ2.2 IC1.2
  Bottom 0.152: IC1.2 IC1.3
N$15
  Top 0.152: R4.2 IC2.3
  Bottom 0.152: IC2.3 IC2.2
N$16
  Top 0.152: LED1.C 55.24,33.5 55.24,45.09 54.61,45.72 R13.2
N$17
  Top 0.152: R14.2 44.94,46.99 T2.B
N$18
  Top 0.152: R5.2 49.05,72.39 OK2.3
N$19
  Top 0.152: R6.2 48.41,84.45 OK3.3
N$20
  Top 0.15: R15.2 Q1.G
N$21
  Top 0.15: R16.2 Q2.G
N$22
  Top 0.15: R17.2 71.91,17.3 73.03,18.41 73.03,33.02 71.12,34.92 Q3.G
N$23
  Top 0.15: Q4.G 89.53,39.37 90.17,38.73 90.17,29.84 85.72,25.4 85.72,18.41 84.61,17.3 R18.2
N$24
  Top 0.15: Q5.G 71.12,57.78 69.85,59.05 59.05,59.05 58.42,58.42 58.42,26.67 59.05,26.04 62.87,26.04 64.77,24.13 64.77,18.41 65.89,17.3 R19.2
N$25
  Top 0.15: Q6.G 90.81,57.15 91.44,56.52 91.44,26.04 89.05,23.65 R20.2
N$26
  Top 0.152: T1.E R11.1
N$27
  Top 0.152: LED2.C R11.2
N$28
  Top 0.15: Q7.G 71.12,64.14 69.85,65.41 58.42,65.41 57.78,64.77 57.78,26.04 58.42,25.4 62.87,25.4 64.14,24.13 64.14,18.41 63.02,17.3 R21.2
N$29
  Top 0.15: Q8.G 91.44,63.5 92.08,62.87 92.08,27.94 92.71,27.3 R22.2
N$30
  Top 0.15: Q9.G 71.12,89.53 69.85,90.81 57.15,90.81 55.88,89.53 55.88,33.02 55.88,30.48 | 55.88,30.48 55.88,17.78 56.52,17.14 57.63,17.14 R23.2 | 55.88,30.48
N$31
  Top 0.15: Q10.G 93.34,88.27 93.98,87.63 93.98,28.57 97.16,25.4 R24.2
N$32
  Top 0.15: Q11.G 71.12,51.44 69.85,52.7 59.69,52.7 59.05,52.07 59.05,27.3 59.69,26.67 62.87,26.67 66.52,23.01 R25.2
N$33
  Top 0.15: Q12.G 90.17,50.16 90.81,49.53 90.81,29.21 86.36,24.77 86.36,18.41 87.48,17.3 R26.2
N$34
  Top 0.15: Q13.G 71.12,76.2 69.22,78.11 58.42,78.11 57.15,76.83 57.15,26.04 58.42,24.77 61.59,24.77 62.23,24.13 R27.2
N$35
  Top 0.15: Q14.G 92.08,75.56 92.71,74.93 92.71,28.57 94.61,26.67 94.61,19.2 R28.2
N$36
  Top 0.15: Q15.G 71.12,83.19 69.85,84.45 57.78,84.45 56.52,83.19 56.52,23.5 57.15,22.86 57.3,23.01 R29.2
N$37
  Top 0.15: Q16.G 92.71,81.92 93.34,81.28 93.34,28.57 95.25,26.67 95.25,19.2 R30.2
N$38
  Bottom 0.152: S1.9 3.81,32.38 2.54,31.11 U$1.D12
N$39
  Bottom 0.152: U$1.D11 5.08,31.11 6.35,32.38 S1.10
N$40
  Bottom 0.152: U$1.D10 7.62,31.11 8.89,32.38 S1.11
N$41
  Bottom 0.152: U$1.D9 10.16,31.11 11.43,32.38 S1.12
N$42
  Bottom 0.152: U$1.D8 12.7,31.11 13.97,32.38 S1.13
N$43
  Bottom 0.152: U$1.D7 15.24,31.11 16.51,32.38 S1.14
N$44
  Bottom 0.152: U$1.D6 17.78,31.11 19.05,32.38 S1.15
N$45
  Bottom 0.152: S1.16 21.59,32.38 20.32,31.11 U$1.D5
N$46
  Top 0.152: SJ4.1 30.1,37.85 35.56,32.38 U$1.RX1
N$47
  Top 0.152: U$1.TX0 38.1,38.35 SJ3.1
N$48  (via drill 0.35)
  Top 0.152: SJ3.3 v32.38,39.37
  Bottom 0.152: v32.38,39.37 31.75,39.37 27.94,35.56 U$1.D2
N$49
  Top 0.152: SJ4.3 27.05,30.86 25.4,29.21 U$1.D3
N$50
  Top 0.254: R50.2 LED3.C
N$51
  Bottom 0.406: D1.A 6.35,51.44 3.17,54.61 JP8.3
N$52
  Top 0.406: C11.1 D1.C
  Bottom 0.406: D1.C 12.7,62.87 IC3.IN
N$53
  Bottom 0.15: U$1.A7 27.94,12.7 29.21,13.97 36.2,13.97 36.83,13.34 36.83,5.08 39.37,2.54 JP7.1
N$54
  Bottom 0.15: JP7.2 43.18,5.71 39.37,9.53 39.37,13.34 38.1,14.61 27.94,14.61 U$1.A6
N$55
  Top 0.15: U$1.A3 19.68,13.97 39.37,13.97 45.72,7.62 JP7.3
N$56
  Top 0.15: U$1.A2 17.78,14.61 40.01,14.61 48.26,6.35 JP7.4
N$57
  Top 0.15: U$1.A1 15.88,15.24 41.27,15.24 50.8,5.71 JP7.5
N$58
  Top 0.15: U$1.A0 13.97,15.88 43.18,15.88 53.34,5.71 JP7.6
N$59
  Top 0.152: R31.2 53.49,25.07 LED4.C
OUT0
  Bottom 1.27: Q13.D 68.58,73.66 70.58,71.66 86.93,71.66 88.93,73.66 JP2.1
OUT1
  Bottom 1.27: Q14.D 81.28,74.3 82.55,73.03 86.36,73.03 89.53,76.2 JP2.2
OUT2
  Bottom 1.27: Q15.D 68.58,80.64 71.22,78 88.2,78 88.93,78.74 JP2.3
OUT3
  Bottom 1.27: Q16.D 81.28,81.28 83.19,79.38 87,79.38 88.9,81.28 JP2.4
OUT4
  Bottom 1.27: Q9.D 68.58,86.36 70.58,84.36 87.73,84.36 88.27,83.82 JP2.5
OUT5
  Bottom 1.27: JP2.6 88.27,86.36 87.63,85.72 82.55,85.72 81.28,87 Q10.D
OUT6
  Bottom 1.27: Q11.D 68.58,48.26 70.58,46.26 88.8,46.26 91.44,48.9 JP3.1
OUT7
  Bottom 1.27: Q12.D 81.28,48.9 82.55,47.62 87.63,47.62 91.44,51.44 JP3.2
OUT8
  Bottom 1.27: Q5.D 68.58,55.88 71.75,52.7 89.53,52.7 90.81,53.98 JP3.3
OUT9
  Bottom 1.27: Q6.D 81.28,55.24 81.92,54.61 86.36,54.61 88.27,56.52 JP3.4
OUT10
  Bottom 1.27: Q7.D 68.58,61.59 70.77,59.41 86.34,59.41 86.7,59.05 JP3.5
OUT11
  Bottom 1.27: JP3.6 86.36,61.59 85.72,60.96 81.92,60.96 81.28,61.59 Q8.D
OUT12
  Bottom 1.27: Q1.D 68.58,29.21 71.12,26.67 87,26.67 89.53,29.21 JP4.1
OUT13
  Bottom 1.27: JP4.2 88.9,31.75 85.72,28.57 81.92,28.57 81.28,29.21 Q2.D
OUT14
  Bottom 1.27: JP4.3 69.85,34.29 68.58,35.56 Q3.D
OUT15
  Bottom 1.27: Q4.D 81.28,38.1 82.55,36.83 JP4.4
SCL  (via drill 0.35)
  Top 0.15: U$2.26 61.98,4.7 49.53,17.14 R10.1 49.53,20.95 v47.62,20.95
  Bottom 0.15: 24.13,15.88 26.67,18.41 43.18,18.41 45.72,20.95 v47.62,20.95
  Bottom 0.152: U$1.A5 22.86,14.61 24.13,15.88
SDA  (via drill 0.35)
  Top 0.15: U$2.27 61.99,4.04 45.09,20.95 R9.1 44.3,22.07 v43.18,20.95
  Bottom 0.15: 22.23,15.24 27.94,20.95 v43.18,20.95
  Bottom 0.152: U$1.A4 20.32,13.34 22.23,15.24
STAT  (via drill 0.35)
  Top 0.152: R31.1 v53.34,19.68 | v30.48,22.23 29.21,22.23 23.5,16.51 12.06,16.51 v10.79,15.24
  Bottom 0.152: v53.34,19.68 51.44,19.68 47.62,23.5 35.56,23.5 34.29,22.23 v30.48,22.23 | v10.79,15.24 10.16,14.61 3.81,14.61 2.54,13.34 U$1.D13
VCC  (via drill 0.35)
  Top 0.15: C7.2 28.07,53.98 DC1.2 | C8.2 75.44,15.24 74.93,14.73 v74.93,13.34 | C9.2 v72.39,2.54 73.25,3.4 U$2.28 | R9.2 R10.2 50.65,26.04 LED1.A | R9.2 42.06,24.92 41.27,24.13 | C6.2 R9.2 | JP7.8 58.42,5.71 v45.72,18.41
  Top 0.152: OK2.2 42.55,69.85 | 42.55,69.85 42.55,81.28 43.18,81.92 OK3.2 | OK1.8 42.55,64.77 42.55,69.85 | LED1.A LED2.A v48.26,35.56 | v48.26,49.53 47.62,49.53 v45.72,51.44 | LED4.A 50.65,26.04
  Top 0.254: v48.26,35.56 41.91,35.56 41.27,34.92 41.27,24.13 | v45.72,18.41 43.18,18.41 41.27,20.32 41.27,24.13 | 24.13,25.4 25.4,24.13 41.27,24.13 | DC1.2 23.5,53.98 22.86,53.34 22.86,50.8 24.13,49.53 24.13,25.4 | LED3.A 33.81,3.96 33.66,3.81 15.24,3.81 14.61,4.45 SJ1.2 14.61,7.62 13.97,8.26 10.16,8.26 8.89,9.53 8.89,24.13 10.16,25.4 24.13,25.4
  Top 0.406: IC3.OUT 15.88,55.88 17.91,53.84 C10.2
  Bottom 0.15: v74.93,13.34 74.93,3.81 73.66,2.54 v72.39,2.54 71.75,3.17 71.75,5.71 59.05,18.41 v45.72,18.41
  Bottom 0.152: DC1.2 26.67,53.98 29.84,50.8 41.27,50.8 42.55,52.07 42.55,61.59 43.81,62.87 OK1.8 46.35,62.87 46.99,62.23 46.99,52.7 v45.72,51.44 | v48.26,35.56 v48.26,49.53
  Bottom 0.406: IC3.OUT 15.88,55.88 17.78,53.98 DC1.2

### Text on the board
tPlace: D-A&B = DMX / R-A&B = RDM | M1=DMX send and / recieve (D4) / M2=only recieve | DMX TO 16 PWM-CHANNELS | with POWER-MOSFETS | v1.0 | e.g. for LED stripes | 0-5 | (in & out) | DMX / RDM | GND | M1 | !!! ONLY RESISTIVE LOADS !!! | CH0 | GND | M2 | CH1 | D-A | CH2 | D-B | CH3 | R-A | CH4 | R-B | CH5 | SDB#018 - sdb.julian-w.de / ! ONLY RESISTIVE LOADS ! | 6-11 | 7805 | GND | 7-12V | GND | isolated / DC-DC Conv. | CH6 | CH7 | CH8 | VCC | CH9 | CH10 | design by Julian Wolter - julian-w.de / 08.12.2018 - v1.0 - nrkrz.de/l/dmx16a | BC856 | CH11 | DMX ADDRESS | suitable MOSFETS: IRLZ34N, / IRL3103, IRL3705N, IRF3708 | PNP | 12-15 | RX | TX | GND | BC856 | CH12 | D3 | RX | D2 | Pin-Mapping | TX | TX | CH13 | + - | DMX | CH14 | RX | + - | CH15 | STAT | Arduino Nano | PCA9685PW / A0-5 = GND | - + | 4x GND | A7 | A6 | A3 | A2 | A1 | A0 | GND | VCC | 5V | 3.3V | PWR | breakout / Pins | Power EITHER from USB or external